# Altium schematic sheet [3]STM32F334R8T6Board_Interfaces.SchDoc
size B
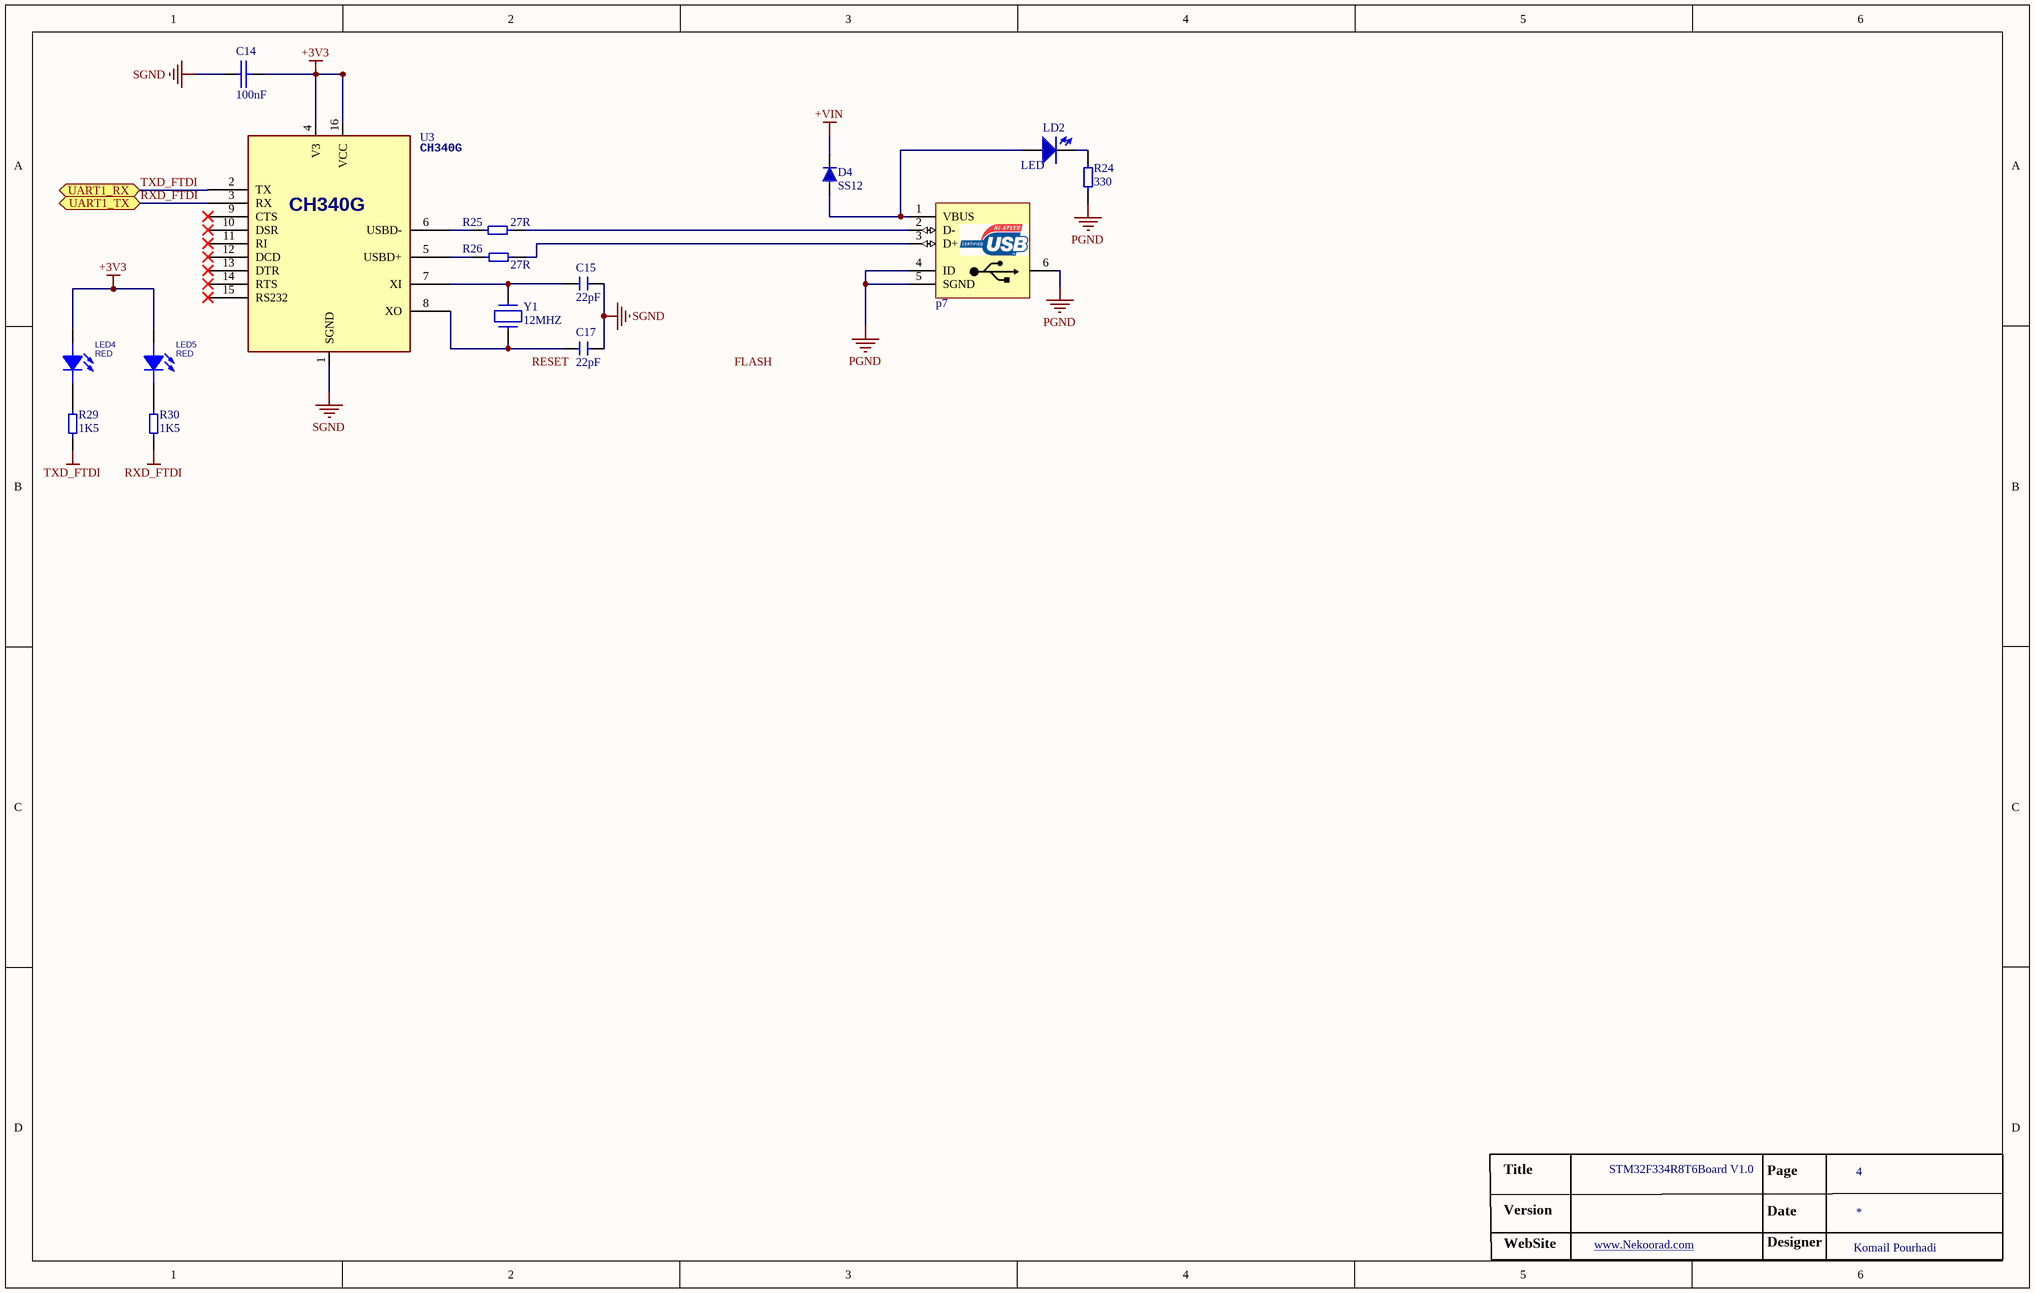
[diagram p0: [3]STM32F334R8T6Board_Interfaces.SchDoc]

## Parts
C14  value 100nF  [SMD_CAP_1206]  (hidden comment: Comment)
C15  Comment  [SMD_CAP_1206]  (value not drawn)
C17  Comment  [SMD_CAP_1206]  (value not drawn)
D4  SS12  [Diode SMA-M]
LD2  LED  [LED_0805 Y]
LED4  RED  [LED SMD 1206]
LED5  RED  [LED SMD 1206]
p7  USB Connector  [USB Micro]  (value not drawn)
R24  Comment  [RES_1206]  (value not drawn)
R25  Comment  [RES_1206]  (value not drawn)
R26  Comment  [RES_1206]  (value not drawn)
R29  RESISTOR  [RES_1206]  (value not drawn)
R30  RESISTOR  [RES_1206]  (value not drawn)
U3  CH340G  [Header smd 2*8]
Y1  12MHZ  [Crystal SMD]

## Ports
UART1_RX (bidir), UART1_TX (bidir)

## Nets
+3V3: C14.2(-) LED4.1(ANODE) LED5.1(ANODE) U3.4(V3) U3.16(VCC)
+VIN: D4.2(K)
PGND: p7.4(ID) p7.5(SGND) p7.6(MH) R24.2
RXD_FTDI: R30.1 U3.3(RX) ; port UART1_TX
SGND: C14.1(+) C15.1 C17.2 U3.1(SGND)
TXD_FTDI: R29.1 U3.2(TX) ; port UART1_RX
NetC15_2: C15.2 U3.7(XI) Y1.2
NetC17_1: C17.1 U3.8(XO) Y1.1
NetD4_1: D4.1(A) LD2.1(A) p7.1(VBUS)
NetLD2_2: LD2.2(K) R24.1
NetLED4_2: LED4.2(CATHODE) R29.2
NetLED5_2: LED5.2(CATHODE) R30.2
Netp7_2: p7.2(D-) R25.2
Netp7_3: p7.3(D+) R26.2
NetR25_1: R25.1 U3.6(USBD-)
NetR26_1: R26.1 U3.5(USBD+)

Not connected (* = marked no-connect by the designer): U3 9(CTS)* 10(DSR)* 11(RI)* 12(DCD)* 13(DTR)* 14(RTS)* 15(RS232)*

## Notes on the sheet
- Title
- STM32F334R8T6Board V1.0
- Page
- 4
- Version
- WebSite
- www.Nekoorad.com <http://www.Nekoorad.com>
- Date
- Designer
- Komail Pourhadi
- Labels drawn without touching a wire or pin: FLASH, RESET
- (in symbol Capacitor SMD) 22pF
- (in symbol Resistor SMD) 1K5; 27R; 330

## Library data of the parts
C14 = Cap-Bipolar: Bipolar Capacitor; Voltage: 100V; Designer: Saeid Jorablo; Organazation: ControTec; Adding Date: 1387/12/20
C15 C17 = Capacitor SMD
D4 = 1N4001
LD2 = LED SMD
LED4 LED5 = LED 5MM: Light Emitting Diode; Designer: Abbas Basereh; Data: 16-12-2016; Link: *; Part.No: *
p7 = USB AB MICRO CONNECTOR: USB MICRO-B Type Connector; Designer: ABBAS BASEREH; Max Current: 1600mA; Mounting Technology: Surface Mount\Through-Hole; Category: Connector; Pin Count: 5-7; Publisher: ABBAS BASEREH; Status: Unreleased; ComponentLink1Description: Datasheet; ComponentLink2Description: Reference; Update: 1395-11-17
R24-R26 R29 R30 = Resistor SMD
U3 = CH340G_SOP16: USB-UART; MANF_P#: CH340G; VALUE: CH340G
Y1 = Xtal